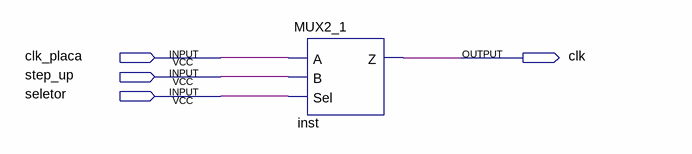
[diagram p0: schematic sheet]
// Quartus schematic run_step_mode.bdf as structural Verilog: 1 symbols, 4 pins
module run_step_mode (
  input  clk_placa,
  input  step_up,
  input  seletor,
  output clk
);

  MUX2_1 inst (.A(clk_placa), .B(step_up), .Sel(seletor), .Z(clk));
endmodule
